# EAGLE design sonar_hotfix (EAGLE 9.0.0)
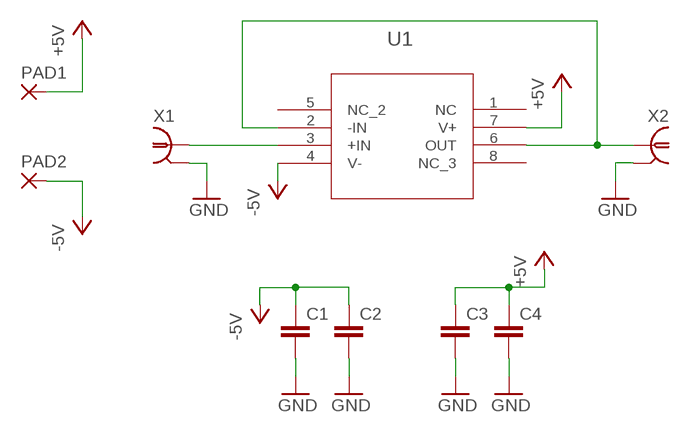
[diagram p0: schematic, sheet 1]

## Parts
C1  C-EUC0603  [C0603]
C2  C-EUC0603  [C0603]
C3  C-EUC0603  [C0603]
C4  C-EUC0603  [C0603]
PAD1  WIREPADSMD5-2,5  [5-2,5]
PAD2  WIREPADSMD5-2,5  [5-2,5]
U1  LTC6240SO-8  [SO-8]
X1  0731000105  [0731000105]
X2  0731000105  [0731000105]

## Nets
+5V: C3.1 C4.1 PAD1.1(P) U1.7(V+)
-5V: C1.1 C2.1 PAD2.1(P) U1.4(V-)
GND: C1.2 C2.2 C3.2 C4.2 X1.P$1 X1.P$2 X2.P$1 X2.P$2
N$1: U1.3(+IN) X1.P$3
N$2: U1.2(-IN) U1.6(OUT) X2.P$3
Unconnected: U1.1(NC) U1.5(NC_2) U1.8(NC_3)

## Library data of the parts
C1-C4 = rcl:C-EU: CAPACITOR, European symbol; SPICEPREFIX: C
PAD1 PAD2 = wirepad:WIREPAD: Wire PAD connect wire on PCB
U1 = hotfix:LTC6240
X1 X2 = hotfix:0731000105

## Board
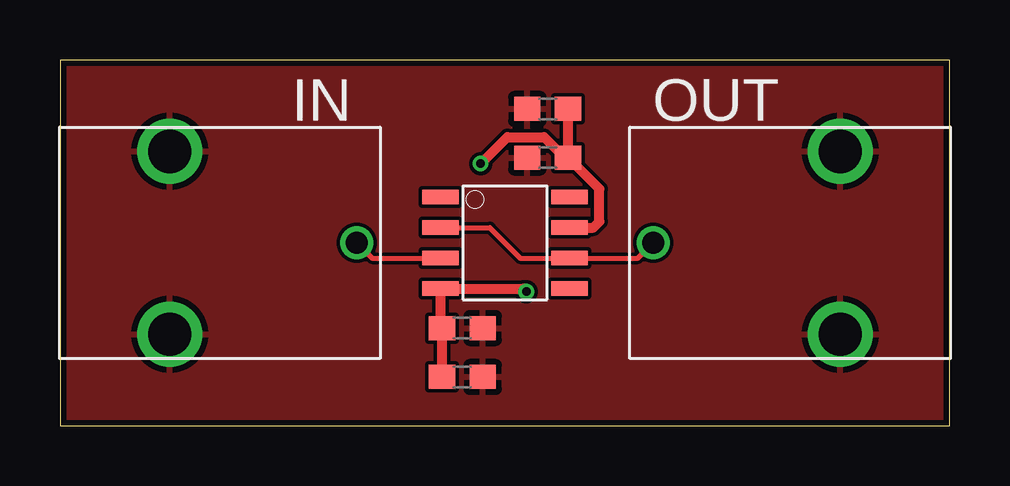
[diagram p1: board, top side]
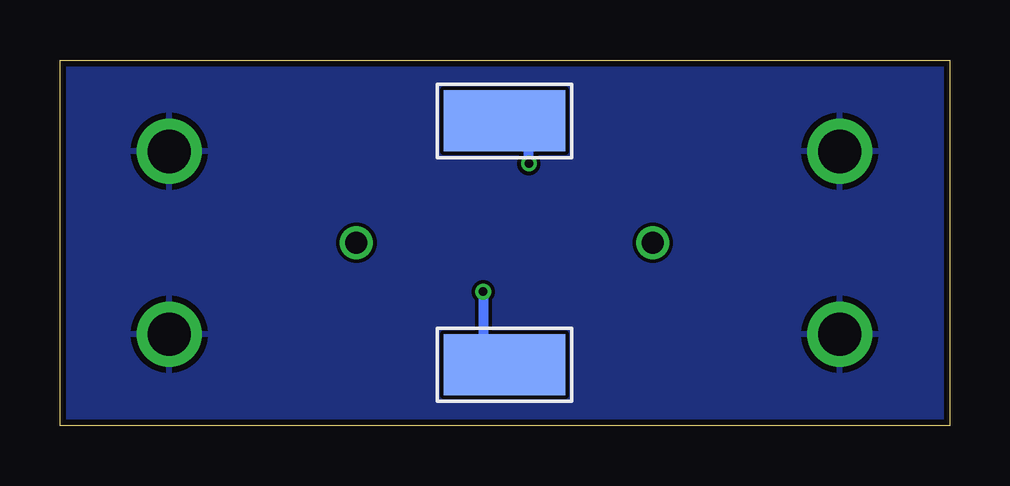
[diagram p2: board, bottom side, seen from below]

Size 37.06 x 15.24 mm. Coordinates in mm from the lower left corner, seen from the top.
Outline: 0,0 37.06,0 37.06,15.24 0,15.24 0,0
Copper layers (1*16): Top 0.035mm / dielectric 1.5mm / Bottom 0.035mm
Design rules "JLCPCB2Layer": minimum track width 6mil, minimum drill 10mil, track to track 6mil, track to pad 6mil, pad to pad 6mil, via to via 6mil, smd to smd 0mil, copper to edge 10mil, drill to drill 10mil, minimum pad ring 6mil, minimum via ring 6mil, stop-mask expansion 2mil, vias tented up to drill 100mil, thermal gap 10mil

### Footprints (pad centres in the part's own frame; a part is rotated, then mirrored left to right if it is on the bottom)
C0603 = smd 1.1 x 1: 1 -0.85,0; 2 0.85,0
5-2,5 = smd 2.54 x 5.08: 1 0,0
SO-8 = smd 1.524 x 0.61: 1 -2.692,1.905; 2 -2.692,0.635; 3 -2.692,-0.635; 4 -2.692,-1.905; 5 2.692,-1.905; 6 2.692,-0.635; 7 2.692,0.635; 8 2.692,1.905
0731000105 = drill 1.803: P$1 3.81,0; P$2 -3.81,0 | drill 0.914: P$3 0,7.798

### Placement (x,y rotation side)
C1  16.76,4.06 0 top
C2  16.76,2.03 0 top
C3  20.32,13.21 180 top
C4  20.32,11.18 180 top
PAD1  18.54,12.7 90 bottom
PAD2  18.54,2.54 90 bottom
U1  18.54,7.62 0 top
X1  4.57,7.62 270 top
X2  32.51,7.62 90 top

### Tracks (layer width: path | path; a pad name or v marks a point on that pad's centre or on a via)
+5V  (via drill 0.35)
  Top 0.406: 17.56,10.96 v17.53,10.92 18.64,12.03 20.17,12.03 21.02,11.18 C4.1 | U1.7 22.23,8.26 22.48,8.51 22.48,9.87 C4.1 | C4.1 C3.1
  Bottom 0.406: v17.53,10.92 17.53,11.68 PAD1.1
-5V  (via drill 0.35)
  Top 0.406: C2.1 C1.1 15.85,4.13 U1.4 19.3,5.71 v19.43,5.59
  Bottom 0.406: v19.43,5.59 19.43,3.43 PAD2.1
GND
  pour Top: 0,15.24 37.08,15.24 37.08,0 0,0
  pour Bottom: 0,15.24 37.08,15.24 37.08,0 0,0
N$1
  Top 0.203: X1.P$3 13.01,6.99 U1.3
N$2
  Top 0.203: U1.2 17.91,8.26 19.18,6.99 U1.6 24.08,6.99 X2.P$3

### Text on the board
tPlace: IN | OUT